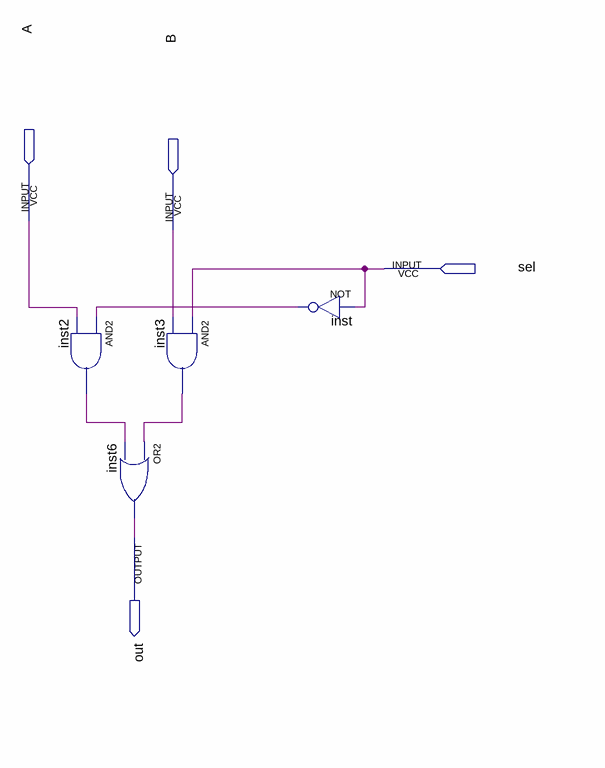
[diagram p0: schematic sheet]
// Quartus schematic MUX2x1.bdf as structural Verilog: 4 symbols, 4 pins
module MUX2x1 (
  input  A,
  input  B,
  input  sel,
  output out
);

  wire inst2_out, inst3_out, inst_out;

  and inst2 (inst2_out, inst_out, A);
  or inst6 (out, inst3_out, inst2_out);
  and inst3 (inst3_out, sel, B);
  not inst (inst_out, sel);
endmodule
